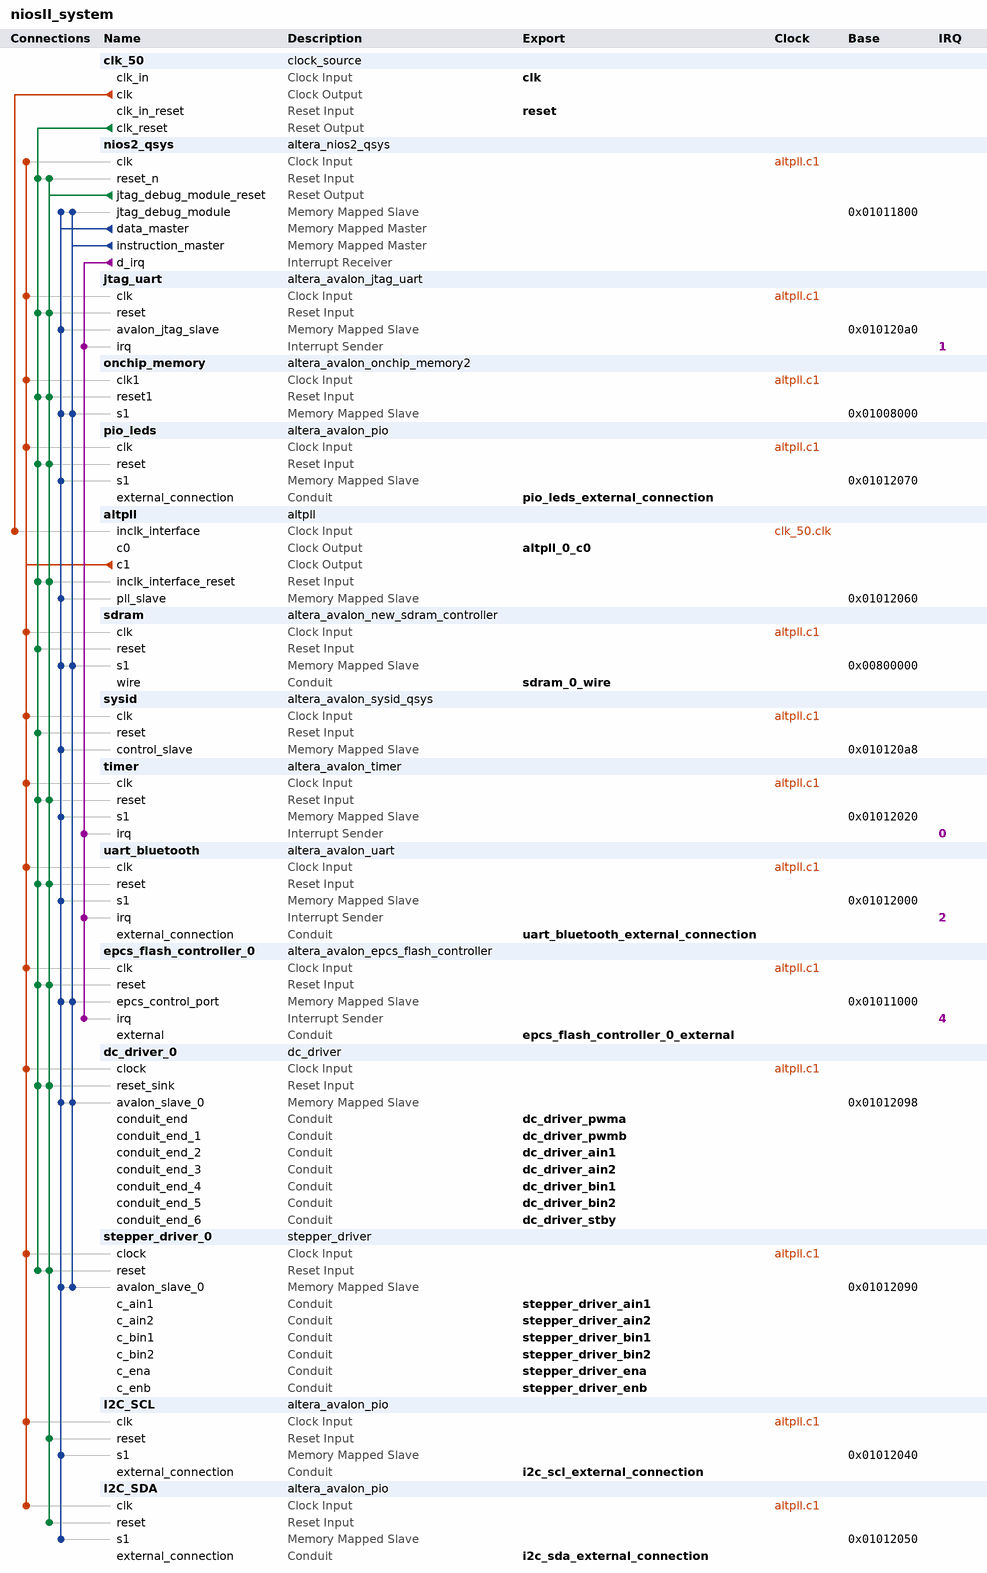
[diagram p0: system contents]
# Platform Designer (Qsys) system niosII_system, Cyclone IV E EP4CE22F17C6
# Parameters at their usual value, and those the tool derives, are not listed.
package require -exact qsys 12.1
create_system niosII_system
set_project_property DEVICE_FAMILY {Cyclone IV E}
set_project_property DEVICE EP4CE22F17C6

add_instance clk_50 clock_source 12.1
set_instance_parameter_value clk_50 clockFrequency 50000000

add_instance nios2_qsys altera_nios2_qsys 12.1
set_instance_parameter_value nios2_qsys resetSlave epcs_flash_controller_0.epcs_control_port
set_instance_parameter_value nios2_qsys exceptionSlave onchip_memory.s1
set_instance_parameter_value nios2_qsys breakSlave nios2_qsys.jtag_debug_module
set_instance_parameter_value nios2_qsys impl Fast
set_instance_parameter_value nios2_qsys icache_size 4096

add_instance jtag_uart altera_avalon_jtag_uart 12.1
set_instance_parameter_value jtag_uart simInteractiveOptions INTERACTIVE_INPUT_OUTPUT

add_instance onchip_memory altera_avalon_onchip_memory2 12.1
set_instance_parameter_value onchip_memory dataWidth 32
set_instance_parameter_value onchip_memory dualPort false
set_instance_parameter_value onchip_memory initMemContent true
set_instance_parameter_value onchip_memory initializationFileName onchip_memory
set_instance_parameter_value onchip_memory memorySize 26000

add_instance pio_leds altera_avalon_pio 12.1
set_instance_parameter_value pio_leds direction Output
set_instance_parameter_value pio_leds width 8

add_instance altpll altpll 12.1
set_instance_parameter_value altpll INCLK0_INPUT_FREQUENCY 20000
set_instance_parameter_value altpll CLK0_MULTIPLY_BY 1
set_instance_parameter_value altpll CLK1_MULTIPLY_BY 1
set_instance_parameter_value altpll CLK0_DIVIDE_BY 1
set_instance_parameter_value altpll CLK1_DIVIDE_BY 1
set_instance_parameter_value altpll CLK0_PHASE_SHIFT -3000
set_instance_parameter_value altpll CLK1_PHASE_SHIFT 0
set_instance_parameter_value altpll CLK1_DUTY_CYCLE 50
set_instance_parameter_value altpll PORT_clk1 PORT_USED
set_instance_parameter_value altpll PORT_clk2 PORT_UNUSED
set_instance_parameter_value altpll PORT_clk3 PORT_UNUSED
set_instance_parameter_value altpll PORT_ARESET PORT_UNUSED
set_instance_parameter_value altpll PORT_LOCKED PORT_UNUSED

add_instance sdram altera_avalon_new_sdram_controller 12.1
set_instance_parameter_value sdram TAC 5.5
set_instance_parameter_value sdram TRCD 20.0
set_instance_parameter_value sdram TRP 20.0
set_instance_parameter_value sdram casLatency 3
set_instance_parameter_value sdram columnWidth 8
set_instance_parameter_value sdram dataWidth 16
set_instance_parameter_value sdram generateSimulationModel false
set_instance_parameter_value sdram model custom
set_instance_parameter_value sdram numberOfBanks 4
set_instance_parameter_value sdram numberOfChipSelects 1
set_instance_parameter_value sdram powerUpDelay 100.0
set_instance_parameter_value sdram refreshPeriod 15.625
set_instance_parameter_value sdram rowWidth 12

add_instance sysid altera_avalon_sysid_qsys 12.1
set_instance_parameter_value sysid id 0

add_instance timer altera_avalon_timer 12.1
set_instance_parameter_value timer period 1
set_instance_parameter_value timer periodUnits MSEC
set_instance_parameter_value timer timerPreset CUSTOM

add_instance uart_bluetooth altera_avalon_uart 12.1
set_instance_parameter_value uart_bluetooth baud 115200
set_instance_parameter_value uart_bluetooth dataBits 8
set_instance_parameter_value uart_bluetooth fixedBaud true
set_instance_parameter_value uart_bluetooth parity NONE
set_instance_parameter_value uart_bluetooth stopBits 1

add_instance epcs_flash_controller_0 altera_avalon_epcs_flash_controller 12.1

add_instance dc_driver_0 dc_driver 3.0

add_instance stepper_driver_0 stepper_driver 2.0

add_instance I2C_SCL altera_avalon_pio 12.1
set_instance_parameter_value I2C_SCL direction Output
set_instance_parameter_value I2C_SCL width 1

add_instance I2C_SDA altera_avalon_pio 12.1
set_instance_parameter_value I2C_SDA direction Bidir
set_instance_parameter_value I2C_SDA width 1

# connections
add_connection altpll.c1 dc_driver_0.clock clock
add_connection altpll.c1 epcs_flash_controller_0.clk clock
add_connection altpll.c1 I2C_SCL.clk clock
add_connection altpll.c1 I2C_SDA.clk clock
add_connection altpll.c1 jtag_uart.clk clock
add_connection altpll.c1 nios2_qsys.clk clock
add_connection altpll.c1 onchip_memory.clk1 clock
add_connection altpll.c1 pio_leds.clk clock
add_connection altpll.c1 sdram.clk clock
add_connection altpll.c1 stepper_driver_0.clock clock
add_connection altpll.c1 sysid.clk clock
add_connection altpll.c1 timer.clk clock
add_connection altpll.c1 uart_bluetooth.clk clock
add_connection clk_50.clk altpll.inclk_interface clock
add_connection clk_50.clk_reset altpll.inclk_interface_reset reset
add_connection clk_50.clk_reset dc_driver_0.reset_sink reset
add_connection clk_50.clk_reset epcs_flash_controller_0.reset reset
add_connection clk_50.clk_reset jtag_uart.reset reset
add_connection clk_50.clk_reset nios2_qsys.reset_n reset
add_connection clk_50.clk_reset onchip_memory.reset1 reset
add_connection clk_50.clk_reset pio_leds.reset reset
add_connection clk_50.clk_reset sdram.reset reset
add_connection clk_50.clk_reset stepper_driver_0.reset reset
add_connection clk_50.clk_reset sysid.reset reset
add_connection clk_50.clk_reset timer.reset reset
add_connection clk_50.clk_reset uart_bluetooth.reset reset
add_connection nios2_qsys.jtag_debug_module_reset altpll.inclk_interface_reset reset
add_connection nios2_qsys.jtag_debug_module_reset dc_driver_0.reset_sink reset
add_connection nios2_qsys.jtag_debug_module_reset epcs_flash_controller_0.reset reset
add_connection nios2_qsys.jtag_debug_module_reset I2C_SCL.reset reset
add_connection nios2_qsys.jtag_debug_module_reset I2C_SDA.reset reset
add_connection nios2_qsys.jtag_debug_module_reset jtag_uart.reset reset
add_connection nios2_qsys.jtag_debug_module_reset nios2_qsys.reset_n reset
add_connection nios2_qsys.jtag_debug_module_reset onchip_memory.reset1 reset
add_connection nios2_qsys.jtag_debug_module_reset pio_leds.reset reset
add_connection nios2_qsys.jtag_debug_module_reset stepper_driver_0.reset reset
add_connection nios2_qsys.jtag_debug_module_reset timer.reset reset
add_connection nios2_qsys.jtag_debug_module_reset uart_bluetooth.reset reset
add_connection nios2_qsys.data_master altpll.pll_slave avalon
set_connection_parameter_value nios2_qsys.data_master/altpll.pll_slave baseAddress 0x01012060
add_connection nios2_qsys.data_master dc_driver_0.avalon_slave_0 avalon
set_connection_parameter_value nios2_qsys.data_master/dc_driver_0.avalon_slave_0 baseAddress 0x01012098
add_connection nios2_qsys.data_master epcs_flash_controller_0.epcs_control_port avalon
set_connection_parameter_value nios2_qsys.data_master/epcs_flash_controller_0.epcs_control_port baseAddress 0x01011000
add_connection nios2_qsys.data_master I2C_SCL.s1 avalon
set_connection_parameter_value nios2_qsys.data_master/I2C_SCL.s1 baseAddress 0x01012040
add_connection nios2_qsys.data_master I2C_SDA.s1 avalon
set_connection_parameter_value nios2_qsys.data_master/I2C_SDA.s1 baseAddress 0x01012050
add_connection nios2_qsys.data_master jtag_uart.avalon_jtag_slave avalon
set_connection_parameter_value nios2_qsys.data_master/jtag_uart.avalon_jtag_slave baseAddress 0x010120a0
add_connection nios2_qsys.data_master nios2_qsys.jtag_debug_module avalon
set_connection_parameter_value nios2_qsys.data_master/nios2_qsys.jtag_debug_module baseAddress 0x01011800
add_connection nios2_qsys.data_master onchip_memory.s1 avalon
set_connection_parameter_value nios2_qsys.data_master/onchip_memory.s1 baseAddress 0x01008000
add_connection nios2_qsys.data_master pio_leds.s1 avalon
set_connection_parameter_value nios2_qsys.data_master/pio_leds.s1 baseAddress 0x01012070
add_connection nios2_qsys.data_master sdram.s1 avalon
set_connection_parameter_value nios2_qsys.data_master/sdram.s1 baseAddress 0x00800000
add_connection nios2_qsys.data_master stepper_driver_0.avalon_slave_0 avalon
set_connection_parameter_value nios2_qsys.data_master/stepper_driver_0.avalon_slave_0 baseAddress 0x01012090
add_connection nios2_qsys.data_master sysid.control_slave avalon
set_connection_parameter_value nios2_qsys.data_master/sysid.control_slave baseAddress 0x010120a8
add_connection nios2_qsys.data_master timer.s1 avalon
set_connection_parameter_value nios2_qsys.data_master/timer.s1 baseAddress 0x01012020
add_connection nios2_qsys.data_master uart_bluetooth.s1 avalon
set_connection_parameter_value nios2_qsys.data_master/uart_bluetooth.s1 baseAddress 0x01012000
add_connection nios2_qsys.instruction_master dc_driver_0.avalon_slave_0 avalon
set_connection_parameter_value nios2_qsys.instruction_master/dc_driver_0.avalon_slave_0 baseAddress 0x01012098
add_connection nios2_qsys.instruction_master epcs_flash_controller_0.epcs_control_port avalon
set_connection_parameter_value nios2_qsys.instruction_master/epcs_flash_controller_0.epcs_control_port baseAddress 0x01011000
add_connection nios2_qsys.instruction_master nios2_qsys.jtag_debug_module avalon
set_connection_parameter_value nios2_qsys.instruction_master/nios2_qsys.jtag_debug_module baseAddress 0x01011800
add_connection nios2_qsys.instruction_master onchip_memory.s1 avalon
set_connection_parameter_value nios2_qsys.instruction_master/onchip_memory.s1 baseAddress 0x01008000
add_connection nios2_qsys.instruction_master sdram.s1 avalon
set_connection_parameter_value nios2_qsys.instruction_master/sdram.s1 baseAddress 0x00800000
add_connection nios2_qsys.instruction_master stepper_driver_0.avalon_slave_0 avalon
set_connection_parameter_value nios2_qsys.instruction_master/stepper_driver_0.avalon_slave_0 baseAddress 0x01012090
add_connection nios2_qsys.d_irq epcs_flash_controller_0.irq interrupt
set_connection_parameter_value nios2_qsys.d_irq/epcs_flash_controller_0.irq irqNumber 4
add_connection nios2_qsys.d_irq jtag_uart.irq interrupt
set_connection_parameter_value nios2_qsys.d_irq/jtag_uart.irq irqNumber 1
add_connection nios2_qsys.d_irq timer.irq interrupt
set_connection_parameter_value nios2_qsys.d_irq/timer.irq irqNumber 0
add_connection nios2_qsys.d_irq uart_bluetooth.irq interrupt
set_connection_parameter_value nios2_qsys.d_irq/uart_bluetooth.irq irqNumber 2

# exported interfaces
add_interface clk clock sink
set_interface_property clk EXPORT_OF clk_50.clk_in
add_interface reset reset sink
set_interface_property reset EXPORT_OF clk_50.clk_in_reset
add_interface pio_leds_external_connection conduit end
set_interface_property pio_leds_external_connection EXPORT_OF pio_leds.external_connection
add_interface altpll_0_c0 clock source
set_interface_property altpll_0_c0 EXPORT_OF altpll.c0
add_interface sdram_0_wire conduit end
set_interface_property sdram_0_wire EXPORT_OF sdram.wire
add_interface uart_bluetooth_external_connection conduit end
set_interface_property uart_bluetooth_external_connection EXPORT_OF uart_bluetooth.external_connection
add_interface epcs_flash_controller_0_external conduit end
set_interface_property epcs_flash_controller_0_external EXPORT_OF epcs_flash_controller_0.external
add_interface dc_driver_pwma conduit end
set_interface_property dc_driver_pwma EXPORT_OF dc_driver_0.conduit_end
add_interface dc_driver_pwmb conduit end
set_interface_property dc_driver_pwmb EXPORT_OF dc_driver_0.conduit_end_1
add_interface dc_driver_ain1 conduit end
set_interface_property dc_driver_ain1 EXPORT_OF dc_driver_0.conduit_end_2
add_interface dc_driver_ain2 conduit end
set_interface_property dc_driver_ain2 EXPORT_OF dc_driver_0.conduit_end_3
add_interface dc_driver_bin1 conduit end
set_interface_property dc_driver_bin1 EXPORT_OF dc_driver_0.conduit_end_4
add_interface dc_driver_bin2 conduit end
set_interface_property dc_driver_bin2 EXPORT_OF dc_driver_0.conduit_end_5
add_interface dc_driver_stby conduit end
set_interface_property dc_driver_stby EXPORT_OF dc_driver_0.conduit_end_6
add_interface stepper_driver_ena conduit end
set_interface_property stepper_driver_ena EXPORT_OF stepper_driver_0.c_ena
add_interface stepper_driver_enb conduit end
set_interface_property stepper_driver_enb EXPORT_OF stepper_driver_0.c_enb
add_interface stepper_driver_bin2 conduit end
set_interface_property stepper_driver_bin2 EXPORT_OF stepper_driver_0.c_bin2
add_interface stepper_driver_bin1 conduit end
set_interface_property stepper_driver_bin1 EXPORT_OF stepper_driver_0.c_bin1
add_interface stepper_driver_ain2 conduit end
set_interface_property stepper_driver_ain2 EXPORT_OF stepper_driver_0.c_ain2
add_interface stepper_driver_ain1 conduit end
set_interface_property stepper_driver_ain1 EXPORT_OF stepper_driver_0.c_ain1
add_interface i2c_sda_external_connection conduit end
set_interface_property i2c_sda_external_connection EXPORT_OF I2C_SDA.external_connection
add_interface i2c_scl_external_connection conduit end
set_interface_property i2c_scl_external_connection EXPORT_OF I2C_SCL.external_connection

save_system niosII_system.qsys
